# EAGLE design pneumatic circuit (EAGLE 8.5.1)
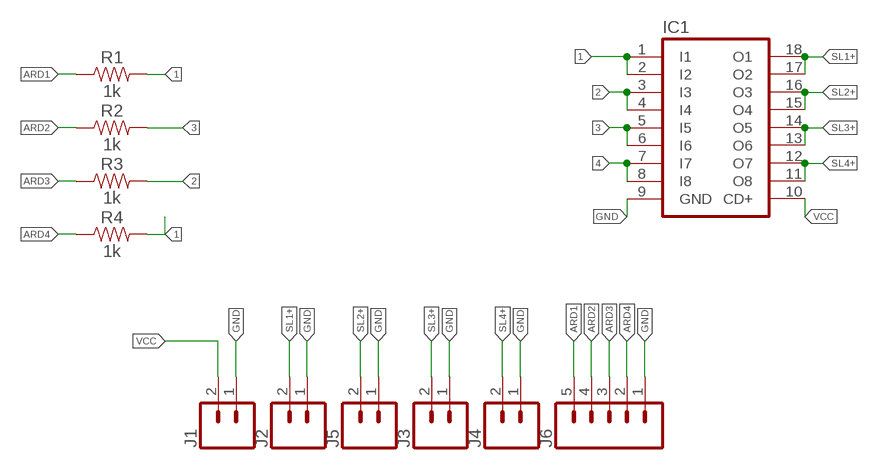
[diagram p0: schematic, sheet 1]

## Parts
IC1  ULN2803A  [DIL18]
J1  CONN_023.5MM  [SCREWTERMINAL-3.5MM-2]
J2  CONN_023.5MM  [SCREWTERMINAL-3.5MM-2]
J3  CONN_023.5MM  [SCREWTERMINAL-3.5MM-2]
J4  CONN_023.5MM  [SCREWTERMINAL-3.5MM-2]
J5  CONN_023.5MM  [SCREWTERMINAL-3.5MM-2]
J6  CONN_05  [1X05]
R1  1k  1KOHM-HORIZ-1/4W-5%  [AXIAL-0.3]
R2  1k  1KOHM-HORIZ-1/4W-5%  [AXIAL-0.3]
R3  1k  1KOHM-HORIZ-1/4W-5%  [AXIAL-0.3]
R4  1k  1KOHM-HORIZ-1/4W-5%  [AXIAL-0.3]

## Nets
1: IC1.1(I1) IC1.2(I2) R4.P$2
2: IC1.3(I3) IC1.4(I4) R3.P$2
3: IC1.5(I5) IC1.6(I6) R2.P$2
4: IC1.7(I7) IC1.8(I8) R1.P$2
ARD1: J6.5 R1.P$1
ARD2: J6.4 R2.P$1
ARD3: J6.3 R3.P$1
ARD4: J6.2 R4.P$1
GND: IC1.9(GND) J1.1 J2.1 J3.1 J4.1 J5.1 J6.1
SL1+: IC1.17(O2) IC1.18(O1) J2.2
SL2+: IC1.15(O4) IC1.16(O3) J5.2
SL3+: IC1.13(O6) IC1.14(O5) J3.2
SL4+: IC1.11(O8) IC1.12(O7) J4.2
VCC: IC1.10(CD+) J1.2

## Library data of the parts
IC1 = uln-udn:ULN2803A: DRIVER ARRAY
J1-J5 = SparkFun-Connectors:CONN_02: Multi connection point. Often used as Generic Header-pin footprint for 0.1 inch spaced/style header connections On any of the 0.1 inch spaced packages, you can populate with these: Break Away Headers - Straight <https://www.sparkfun.com/products/116> (PRT-00116) Break Away Male Headers - Right Angle <https://www.sparkfun.com/products/553> (PRT-00553) Female Headers <https://www.sparkfun.com/products/115> (PRT-00115) Break Away Headers - Machine Pin <https://www.sparkfun.com/products/117> (PRT-00117) Break Away Female Headers - Swiss Machine Pin <https://www.sparkfun.com/products/743> (PRT-00743) For SCREWTERMINALS and SPRING TERMINALS visit here: Screw Terimnals on SparkFun.com <https://www.sparkfun.com/search/results?term=Screw+Terminals> (5mm/3.5mm/2.54mm spacing) This device is also useful as a general connection point to wire up your design to another part of your project. Our various solder wires solder well into these plated through hole pads. Hook-Up Wire - Assortment (Stranded, 22 AWG) <https://www.sparkfun.com/products/11375> (PRT-11375) Hook-Up Wire - Assortment (Solid Core, 22 AWG) <https://www.sparkfun.com/products/11367> (PRT-11367) View the entire wire category on our website here <https://www.sparkfun.com/categories/141> Special notes: Molex polarized connector foot print use with: PRT-08233 with associated crimp pins and housings. 2.54_SCREWTERM for use with PRT-10571. 3.5mm Screw Terminal footprints for PRT-08084 5mm Screw Terminal footprints for use with PRT-08432; PROD_ID: CONN-08399
J6 = SparkFun-Connectors:CONN_05: Multi connection point. Often used as Generic Header-pin footprint for 0.1 inch spaced/style header connections On any of the 0.1 inch spaced packages, you can populate with these: Break Away Headers - Straight <https://www.sparkfun.com/products/116> (PRT-00116) Break Away Male Headers - Right Angle <https://www.sparkfun.com/products/553> (PRT-00553) Female Headers <https://www.sparkfun.com/products/115> (PRT-00115) Break Away Headers - Machine Pin <https://www.sparkfun.com/products/117> (PRT-00117) Break Away Female Headers - Swiss Machine Pin <https://www.sparkfun.com/products/743> (PRT-00743) For SCREWTERMINALS and SPRING TERMINALS visit here: Screw Terimnals on SparkFun.com <https://www.sparkfun.com/search/results?term=Screw+Terminals> (5mm/3.5mm/2.54mm spacing) This device is also useful as a general connection point to wire up your design to another part of your project. Our various solder wires solder well into these plated through hole pads. Hook-Up Wire - Assortment (Stranded, 22 AWG) <https://www.sparkfun.com/products/11375> (PRT-11375) Hook-Up Wire - Assortment (Solid Core, 22 AWG) <https://www.sparkfun.com/products/11367> (PRT-11367) View the entire wire category on our website here <https://www.sparkfun.com/categories/141> Special notes: Molex polarized connector foot print use with SKU : PRT-08231 with associated crimp pins and housings. 1MM SMD Version SKU: PRT-10208
R1-R4 = SparkFun-Resistors:1KOHM: 1kΩ resistor A resistor is a passive two-terminal electrical component that implements electrical resistance as a circuit element. Resistors act to reduce current flow, and, at the same time, act to lower voltage levels within circuits. - Wikipedia; PROD_ID: RES-08380

## Net classes
0 default: width 1 mm, drill 1 mm, clearance 1 mm

## Board
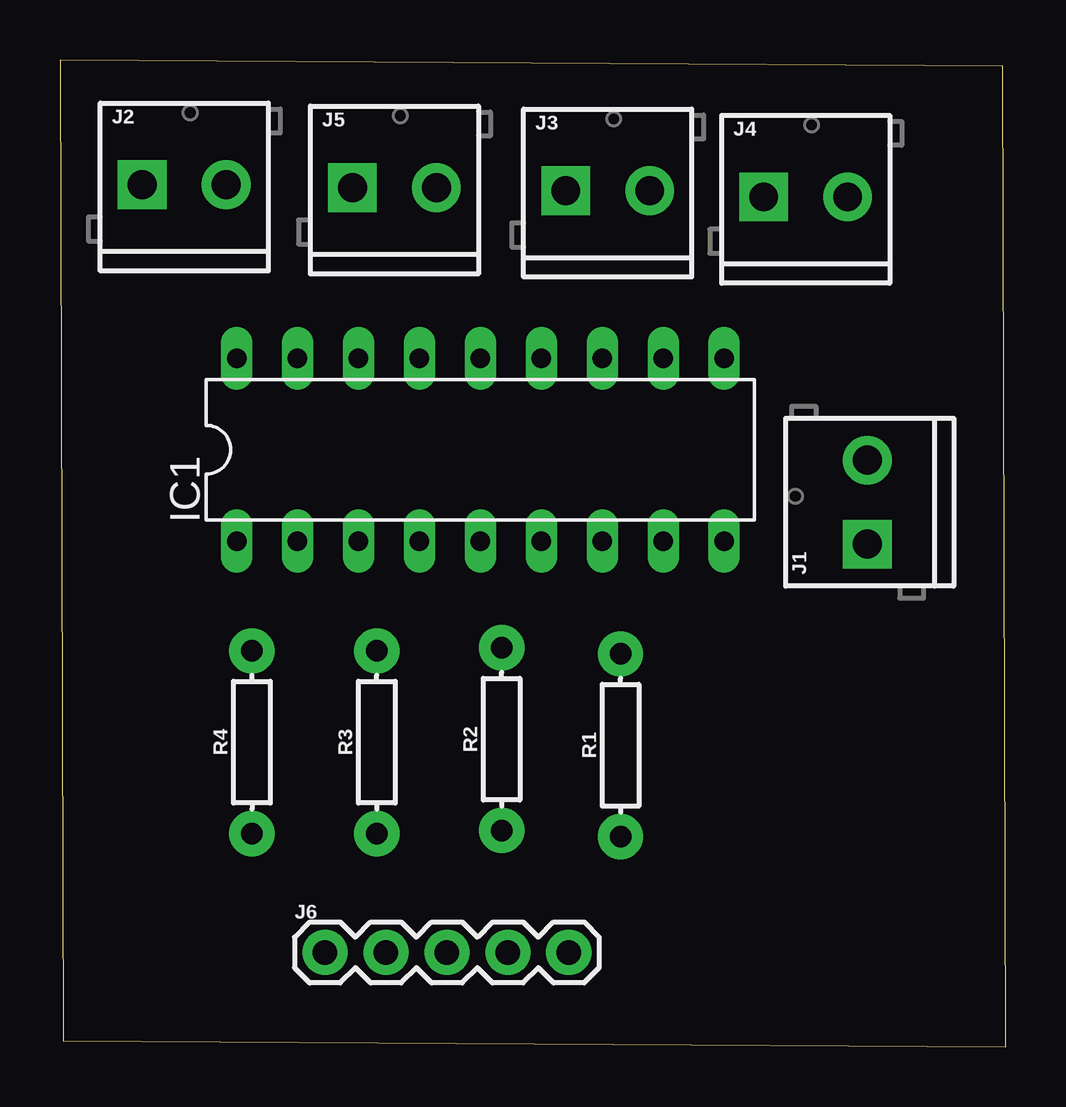
[diagram p1: board, top side]
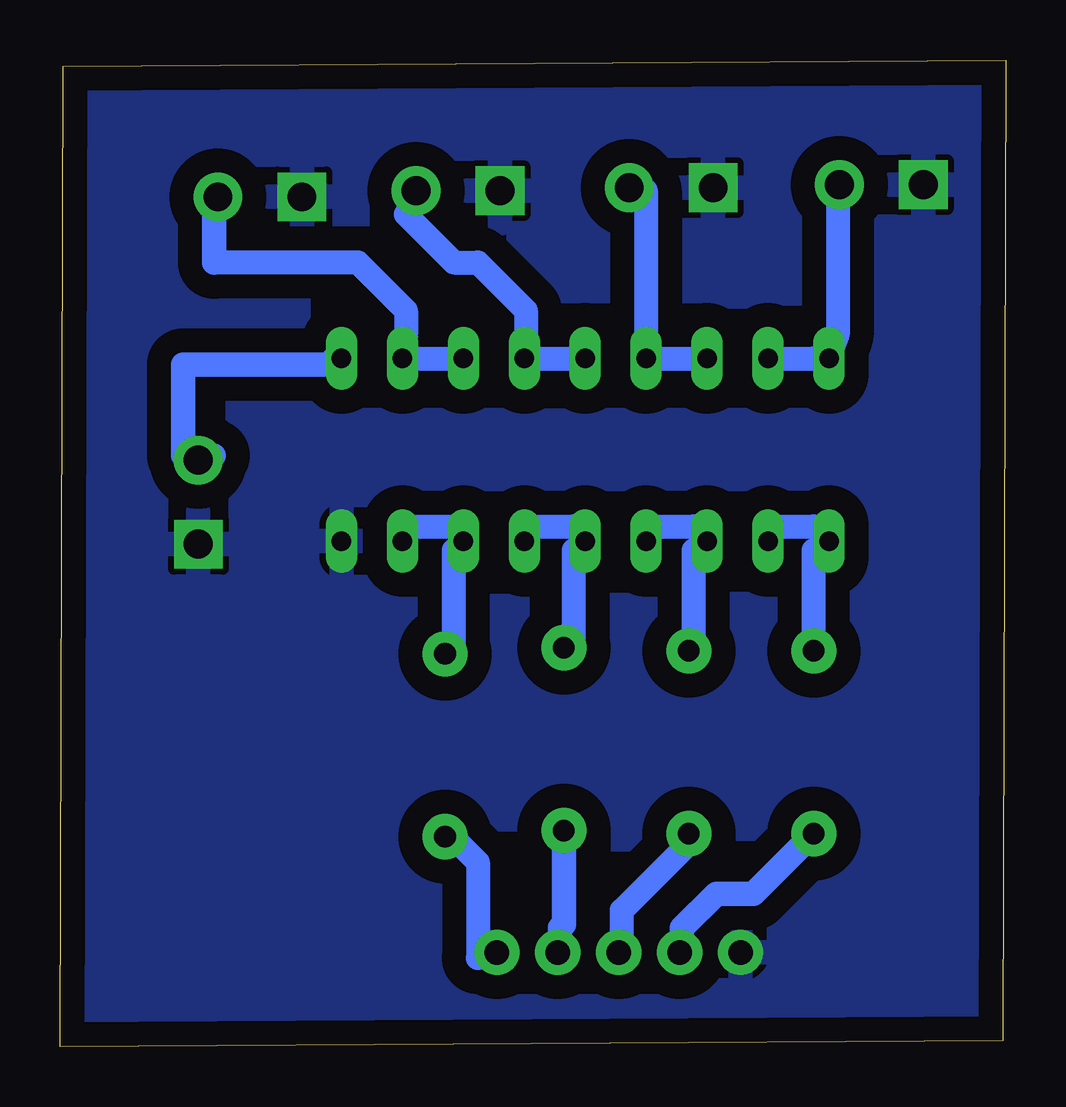
[diagram p2: board, bottom side, seen from below]

Size 39.42 x 41.14 mm. Coordinates in mm from the lower left corner, seen from the top.
Outline: 0.13,0.25 39.42,0 39.29,40.88 0,41.14 0.13,0.25
Copper layers (1*16): Top 0.035mm / dielectric 1.5mm / Bottom 0.035mm
Design rules "default": minimum track width 6mil, minimum drill 0.35mm, track to track 6mil, track to pad 6mil, pad to pad 6mil, via to via 6mil, smd to smd 6mil, copper to edge 40mil, drill to drill 6mil, minimum pad ring 10mil, minimum via ring 8mil, stop-mask expansion 4mil, vias tented up to drill 0mil, thermal gap 10mil

### Footprints (pad centres in the part's own frame; a part is rotated, then mirrored left to right if it is on the bottom)
DIL18 = drill 0.813 long: 1 -10.16,-3.81; 2 -7.62,-3.81; 3 -5.08,-3.81; 4 -2.54,-3.81; 5 0,-3.81; 6 2.54,-3.81; 7 5.08,-3.81; 8 7.62,-3.81; 9 10.16,-3.81; 10 10.16,3.81; 11 7.62,3.81; 12 5.08,3.81; 13 2.54,3.81; 14 0,3.81; 15 -2.54,3.81; 16 -5.08,3.81; 17 -7.62,3.81; 18 -10.16,3.81
SCREWTERMINAL-3.5MM-2 = drill 1.2 pad 2.032 square: 1 0,0 | drill 1.2 pad 2.032: 2 3.5,0
1X05 = drill 1.016 pad 1.88: 1 0,0; 2 2.54,0; 3 5.08,0; 4 7.62,0; 5 10.16,0
AXIAL-0.3 = drill 0.9 pad 1.88: P$1 -3.81,0; P$2 3.81,0

### Placement (x,y rotation side)
IC1  17.53,24.89 0 top
J1  33.66,20.96 90 top
J2  3.43,35.94 0 top
J3  21.08,35.69 0 top
J4  29.34,35.43 0 top
J5  12.19,35.81 0 top
J6  11.05,3.94 0 top
R1  23.37,12.57 90 top
R2  18.41,12.83 90 top
R3  13.21,12.7 90 top
R4  8,12.7 90 top

### Tracks (layer width: path | path; a pad name or v marks a point on that pad's centre or on a via)
1
  Bottom 1: 10,20.7 IC1.2 10,21.7 8,21.7 IC1.1 8,20.7 8,16.7 R4.P$2
2
  Bottom 1: IC1.4 15,21.7 13,21.7 IC1.3 13,20.7 13,16.7 R3.P$2
3
  Bottom 1: IC1.6 20,21.7 18,21.7 IC1.5 18,20.7 18,16.7 R2.P$2
4
  Bottom 1: IC1.8 25,21.7 23,21.7 IC1.7 23,20.7 23,16.7 R1.P$2
ARD1
  Bottom 1: J6.5 22,3.7 22,7.7 23,8.7 R1.P$1
ARD2
  Bottom 1.016: R2.P$1 18.41,5.11 18.58,4.95 18.58,4.03 J6.4
ARD3
  Bottom 1: R3.P$1 13,8.7 16,5.7 16,4.7 J6.3
ARD4
  Bottom 1.016: J6.2 13.5,4.03 13.5,4.95 12.06,6.38 10.51,6.38 R4.P$1
GND
  pour Bottom: -1.27,42.42 40.64,42.42 40.64,-0.76 -1.27,-0.76
SL1+
  Bottom 1: IC1.17 10,28.7 8,28.7 IC1.18 7,29.7 7,35.7 J2.2
SL2+
  Bottom 1: IC1.16 13,28.7 IC1.15 15,29.7 15,35.7 J5.2
SL3+
  Bottom 1: IC1.14 18,28.7 20,28.7 IC1.13 20,29.7 20,30.7 22,32.7 23,32.7 25,34.7 J3.2
SL4+
  Bottom 1: IC1.12 23,28.7 25,28.7 IC1.11 25,29.7 25,30.7 27,32.7 33,32.7
  Bottom 1.016: 33,32.7 33,35.43 J4.2
VCC
  Bottom 1: 28,28.7 IC1.10
  Bottom 1.016: IC1.10 27.69,28.45 34.29,28.45 34.29,24.64 33.66,24.64 | 33.02,24.64 33.66,24.64 | 33.66,24.64 J1.2